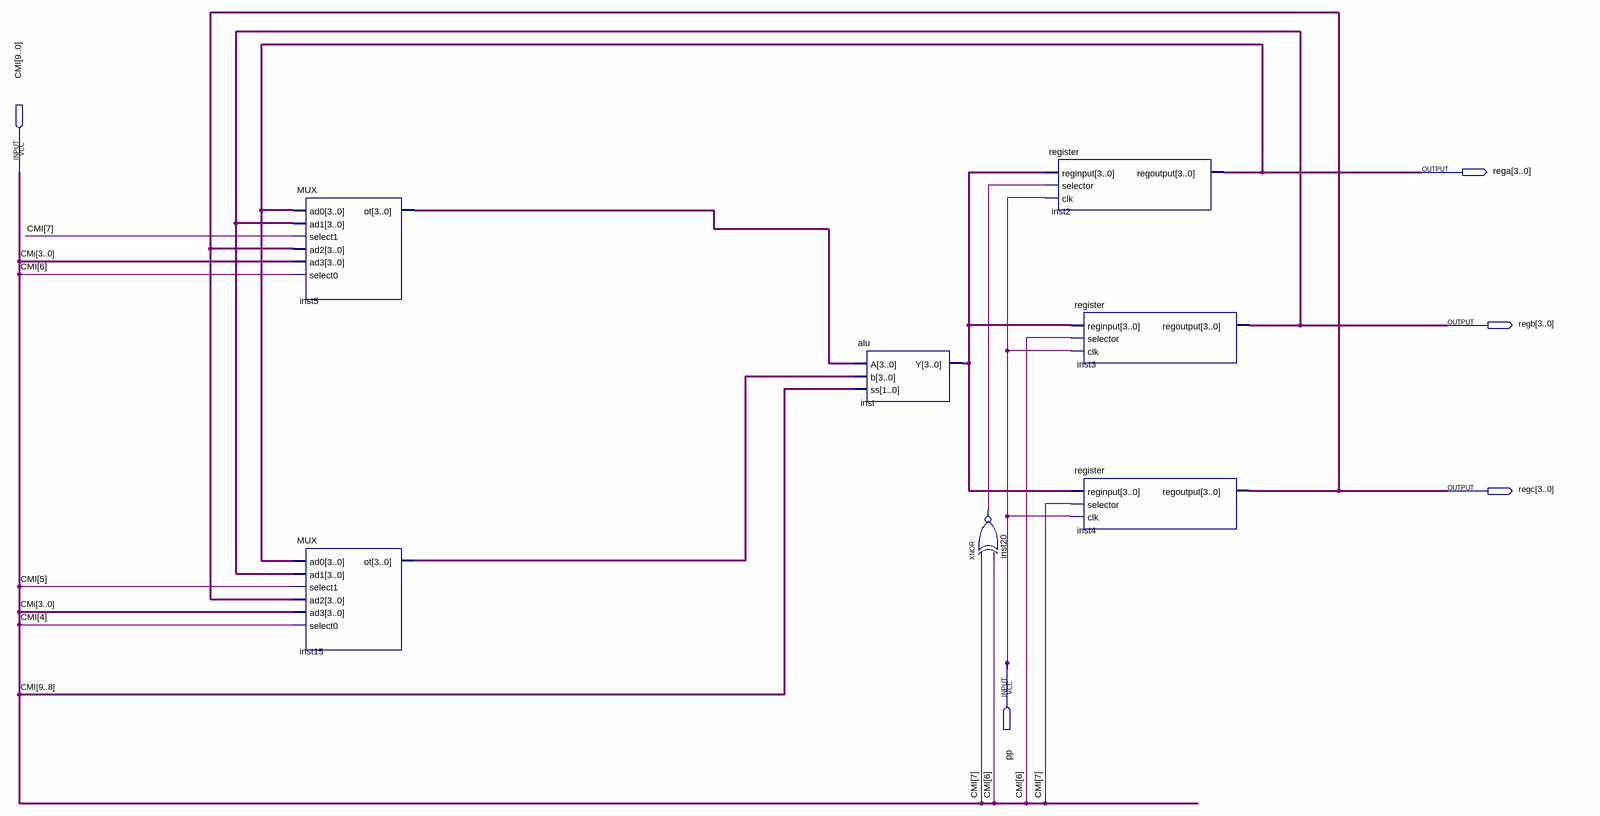
[diagram p0: schematic sheet]
// Quartus schematic testaya.bdf as structural Verilog: 7 symbols, 5 pins
module testaya (
  input  [9:0] CMI,
  input  pp,
  output [3:0] rega,
  output [3:0] regb,
  output [3:0] regc
);

  wire inst20_out;
  wire [3:0] inst5_ot, inst15_ot, inst_y;

  MUX inst5 (.ad0(rega), .ad1(regb), .select1(CMI[7]), .ad2(regc), .ad3(CMI[3:0]), .select0(CMI[6]), .ot(inst5_ot));
  MUX inst15 (.ad0(rega), .ad1(regb), .select1(CMI[5]), .ad2(regc), .ad3(CMI[3:0]), .select0(CMI[4]), .ot(inst15_ot));
  alu inst (.A(inst5_ot), .b(inst15_ot), .ss(CMI[9:8]), .Y(inst_y));
  xnor inst20 (inst20_out, CMI[7], CMI[6]);
  register inst2 (.reginput(inst_y), .selector(inst20_out), .clk(pp), .regoutput(rega));
  register inst3 (.reginput(inst_y), .selector(CMI[6]), .clk(pp), .regoutput(regb));
  register inst4 (.reginput(inst_y), .selector(CMI[7]), .clk(pp), .regoutput(regc));
endmodule
